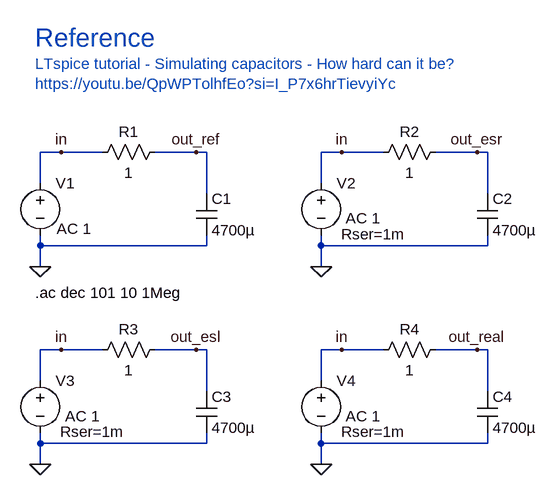
[diagram p0: schematic 03-rc_lowpass.asc]
03-rc_lowpass.asc, the LTspice schematic file:
Version 4
SHEET 1 1652 680
WIRE 48 64 16 64
WIRE 112 64 48 64
WIRE 256 64 192 64
WIRE 272 64 256 64
WIRE 480 64 448 64
WIRE 544 64 480 64
WIRE 688 64 624 64
WIRE 704 64 688 64
WIRE 16 112 16 64
WIRE 448 112 448 64
WIRE 272 128 272 64
WIRE 704 128 704 64
WIRE 16 208 16 192
WIRE 272 208 272 192
WIRE 272 208 16 208
WIRE 448 208 448 192
WIRE 704 208 704 192
WIRE 704 208 448 208
WIRE 16 240 16 208
WIRE 448 240 448 208
WIRE 48 368 16 368
WIRE 112 368 48 368
WIRE 256 368 192 368
WIRE 272 368 256 368
WIRE 480 368 448 368
WIRE 544 368 480 368
WIRE 688 368 624 368
WIRE 704 368 688 368
WIRE 16 416 16 368
WIRE 448 416 448 368
WIRE 272 432 272 368
WIRE 704 432 704 368
WIRE 16 512 16 496
WIRE 272 512 272 496
WIRE 272 512 16 512
WIRE 448 512 448 496
WIRE 704 512 704 496
WIRE 704 512 448 512
WIRE 16 544 16 512
WIRE 448 544 448 512
FLAG 16 240 0
FLAG 48 64 in
FLAG 256 64 out_ref
FLAG 448 240 0
FLAG 480 64 in
FLAG 688 64 out_esr
FLAG 16 544 0
FLAG 48 368 in
FLAG 256 368 out_esl
FLAG 448 544 0
FLAG 480 368 in
FLAG 688 368 out_real
SYMBOL res 208 48 R90
WINDOW 0 0 56 VBottom 2
WINDOW 3 32 56 VTop 2
SYMATTR InstName R1
SYMATTR Value 1
SYMBOL cap 256 128 R0
SYMATTR InstName C1
SYMATTR Value 4700µ
SYMBOL voltage 16 96 R0
WINDOW 123 25 86 Left 2
WINDOW 39 0 0 Left 0
SYMATTR InstName V1
SYMATTR Value ""
SYMATTR Value2 AC 1
SYMBOL cap 688 128 R0
SYMATTR InstName C2
SYMATTR Value 4700µ
SYMATTR SpiceLine Rser=89m
SYMBOL res 640 48 R90
WINDOW 0 0 56 VBottom 2
WINDOW 3 32 56 VTop 2
SYMATTR InstName R2
SYMATTR Value 1
SYMBOL voltage 448 96 R0
WINDOW 123 38 70 Left 2
WINDOW 39 31 94 Left 2
SYMATTR InstName V2
SYMATTR Value ""
SYMATTR Value2 AC 1
SYMATTR SpiceLine Rser=1m
SYMBOL cap 256 432 R0
SYMATTR InstName C3
SYMATTR Value 4700µ
SYMATTR SpiceLine Lser=1u
SYMBOL res 208 352 R90
WINDOW 0 0 56 VBottom 2
WINDOW 3 32 56 VTop 2
SYMATTR InstName R3
SYMATTR Value 1
SYMBOL voltage 16 400 R0
WINDOW 123 38 70 Left 2
WINDOW 39 31 94 Left 2
SYMATTR InstName V3
SYMATTR Value ""
SYMATTR Value2 AC 1
SYMATTR SpiceLine Rser=1m
SYMBOL cap 688 432 R0
SYMATTR InstName C4
SYMATTR Value 4700µ
SYMATTR SpiceLine Rser=80m Lser=1u
SYMBOL res 640 352 R90
WINDOW 0 0 56 VBottom 2
WINDOW 3 32 56 VTop 2
SYMATTR InstName R4
SYMATTR Value 1
SYMBOL voltage 448 400 R0
WINDOW 123 38 70 Left 2
WINDOW 39 31 94 Left 2
SYMATTR InstName V4
SYMATTR Value ""
SYMATTR Value2 AC 1
SYMATTR SpiceLine Rser=1m
TEXT 8 280 Left 2 !.ac dec 101 10 1Meg
TEXT 8 -72 Left 2 ;LTspice tutorial - Simulating capacitors - How hard can it be?\nhttps://youtu.be/QpWPTolhfEo?si=I_P7x6hrTievyiYc
TEXT 8 -112 Left 4 ;Reference

The netlist it stands for:
* 03-rc_lowpass.asc
R1 out_ref in 1
C1 out_ref 0 4700µ
V1 in 0 AC 1
C2 out_esr 0 4700µ Rser=89m
R2 out_esr in 1
V2 in 0 AC 1 Rser=1m
C3 out_esl 0 4700µ Lser=1u
R3 out_esl in 1
V3 in 0 AC 1 Rser=1m
C4 out_real 0 4700µ Rser=80m Lser=1u
R4 out_real in 1
V4 in 0 AC 1 Rser=1m
.ac dec 101 10 1Meg
* LTspice tutorial - Simulating capacitors - How hard can it be?
* https://youtu.be/QpWPTolhfEo?si=I_P7x6hrTievyiYc
* Reference
.backanno
.end

* Results of the author's LTspice run, read from the files saved beside the schematic
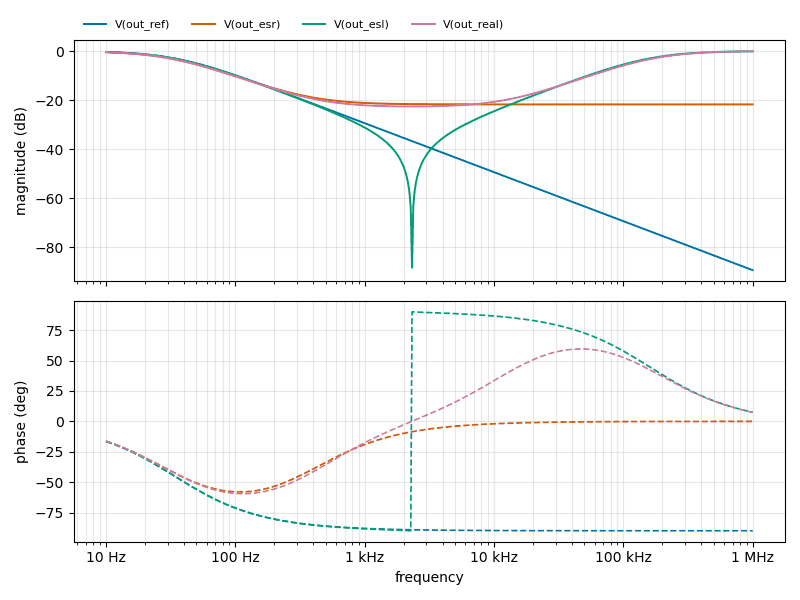
[diagram p1: AC Analysis of 03-rc_lowpass.asc, plotted from the saved traces]
* AC Analysis, 1 run:
*   V(out_ref): -0.36 dB at 10 Hz, -89.41 dB at 1 MHz, peak -0.36 dB at 10 Hz, 3 dB below the peak at 36.7 Hz
*   V(out_esr): -0.42 dB at 10 Hz, -21.75 dB at 1 MHz, peak -0.42 dB at 10 Hz, 3 dB below the peak at 34.39 Hz
*   V(out_esl): -0.36 dB at 10 Hz, -0.07 dB at 1 MHz, peak -0.07 dB at 1 MHz, 3 dB below the peak at 155.9 kHz
*   V(out_real): -0.42 dB at 10 Hz, -0.09 dB at 1 MHz, peak -0.09 dB at 1 MHz, 3 dB below the peak at 166.8 kHz